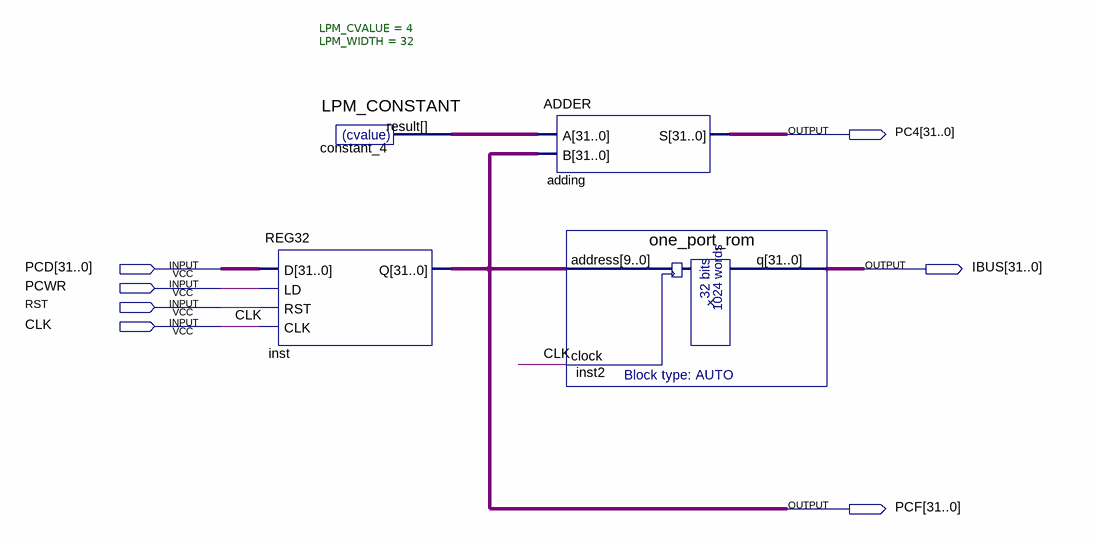
[diagram p0: schematic sheet]
// Quartus schematic fetch.bdf as structural Verilog: 4 symbols, 7 pins
module fetch (
  input  [31:0] PCD,
  input  PCWR,
  input  RST,
  input  CLK,
  output [31:0] PC4,
  output [31:0] IBUS,
  output [31:0] PCF
);

  wire [31:0] constant_4_result;

  REG32 inst (.D(PCD), .LD(PCWR), .RST(RST), .CLK(CLK), .Q(PCF));
  LPM_CONSTANT #(.LPM_CVALUE(4), .LPM_WIDTH(32)) constant_4 (.result(constant_4_result));
  ADDER adding (.A(constant_4_result), .B(PCF), .S(PC4));
  one_port_rom inst2 (.address(PCF), .clock(CLK), .q(IBUS));
endmodule
